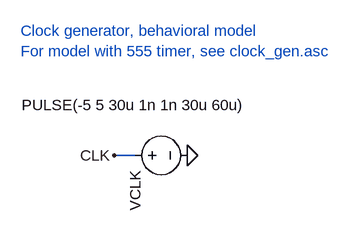
[diagram p0: schematic clock_gen-fast.asc]
clock_gen-fast.asc, the LTspice schematic file:
Version 4
SHEET 1 880 680
WIRE 112 -48 80 -48
FLAG 192 -48 0
FLAG 80 -48 CLK
SYMBOL voltage 96 -48 M90
WINDOW 123 0 0 Left 0
WINDOW 39 0 0 Left 0
WINDOW 3 -78 187 VLeft 0
SYMATTR Value PULSE(-5 5 30u 1n 1n 30u 60u)
SYMATTR InstName VCLK
TEXT -64 -240 Left 0 ;Clock generator, behavioral model\nFor model with 555 timer, see clock_gen.asc

The netlist it stands for:
* clock_gen-fast.asc
VCLK CLK 0 PULSE(-5 5 30u 1n 1n 30u 60u)
* Clock generator, behavioral model
* For model with 555 timer, see clock_gen.asc
.backanno
.end